# EAGLE schematic radiva5 (EAGLE 7.7.0)

## Sheet 1 of 2
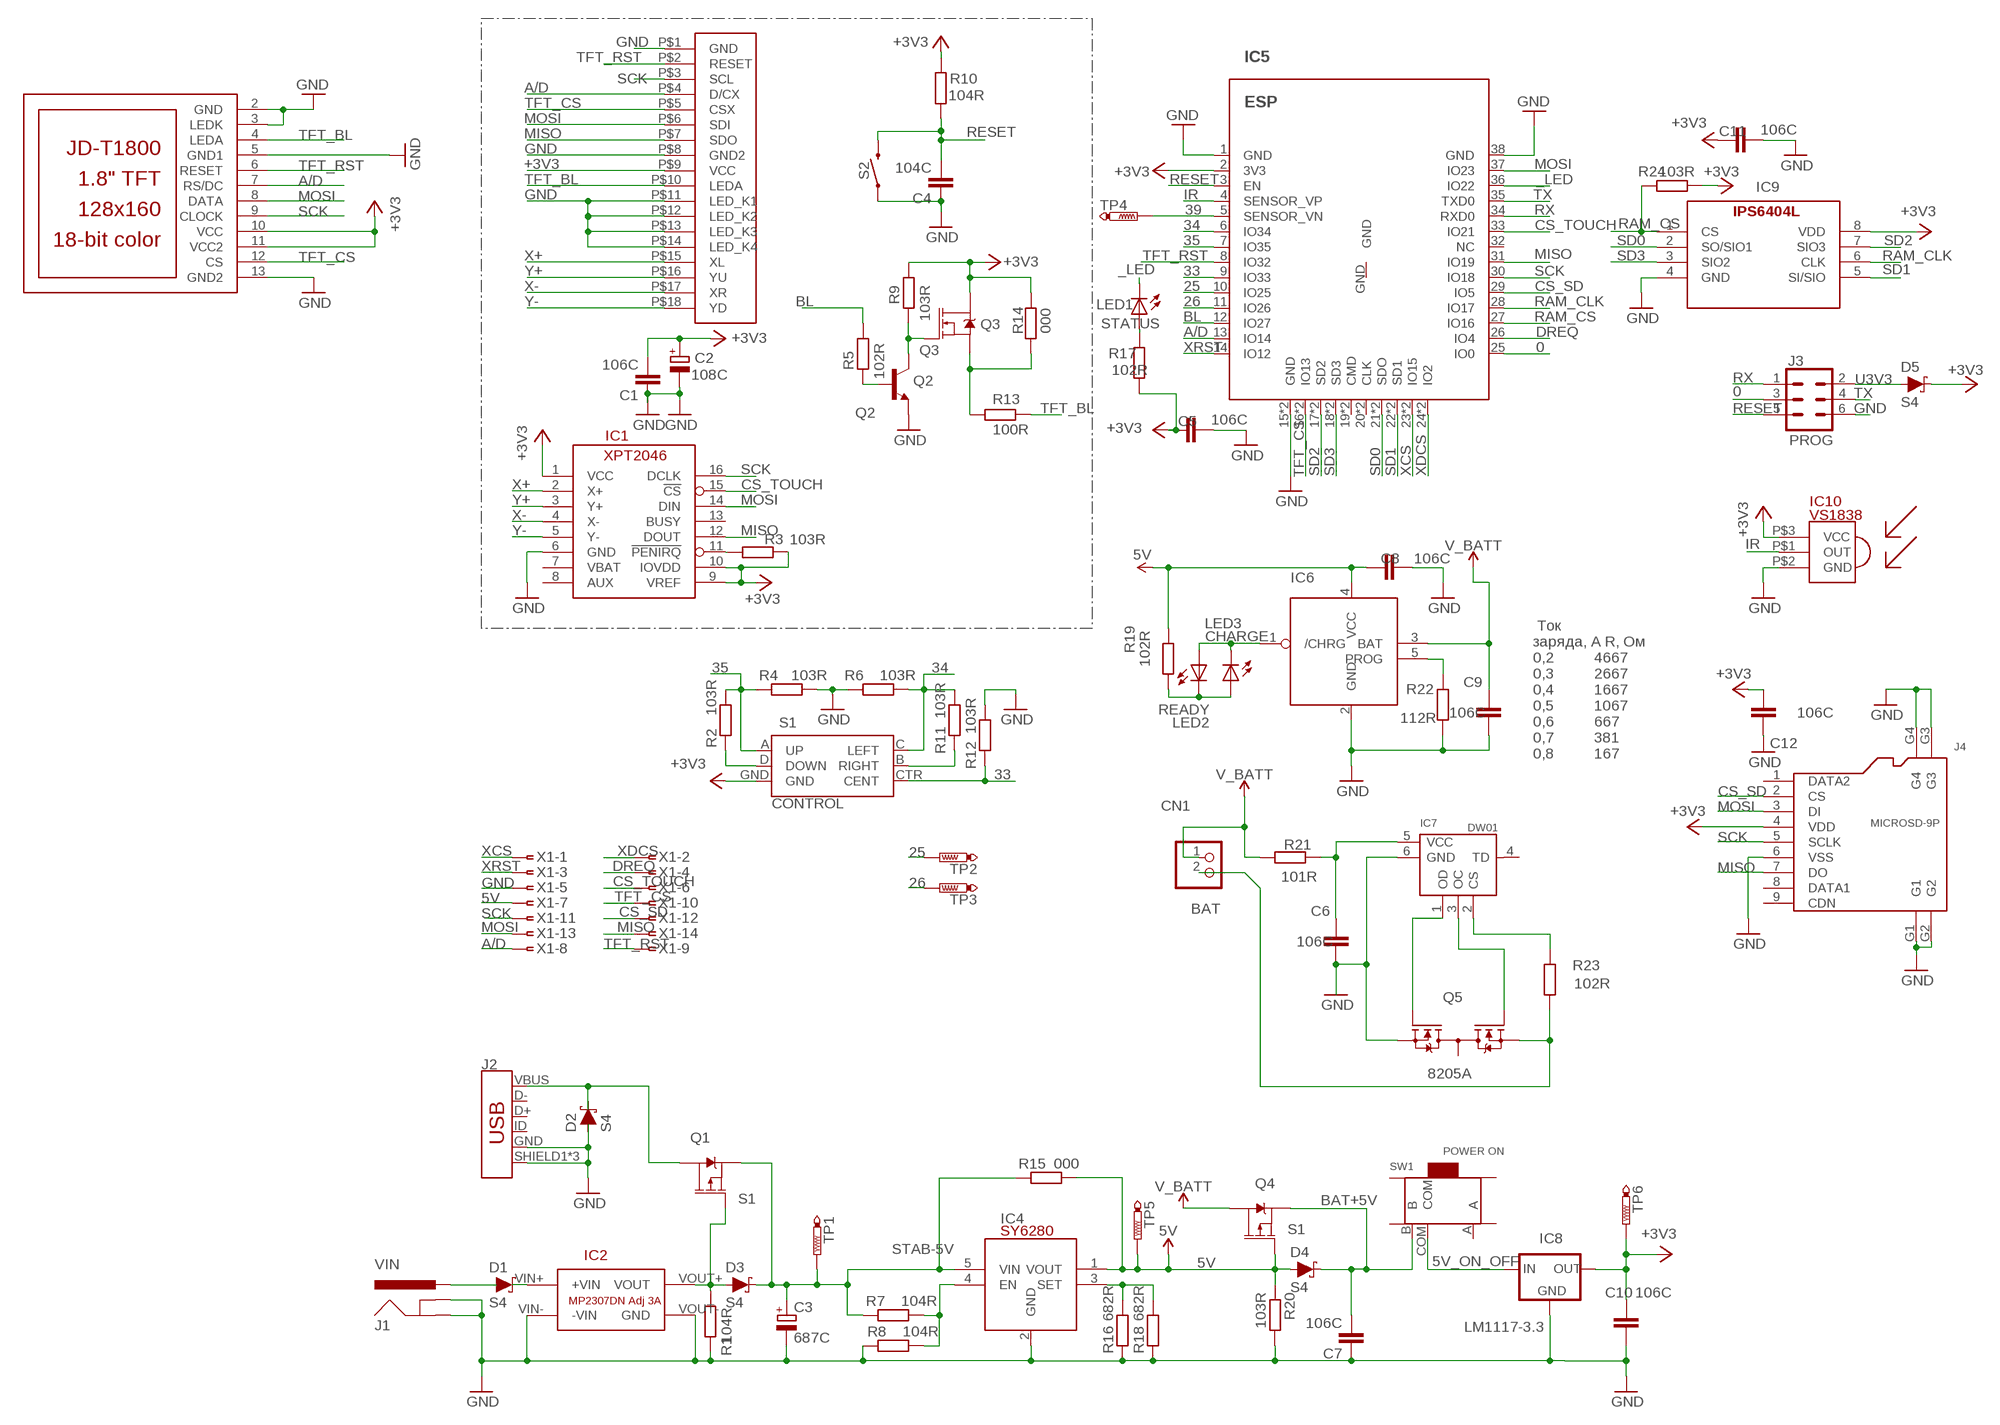
[diagram p0: schematic, sheet 1]

### Parts
C1  106C  CAP0603-CAP  [0603-CAP]
C2  108C  CPOL-EUE5-8.5  [E5-8,5]
C3  687C  CPOL-EUE5-8.5  [E5-8,5]
C4  104C  CAP0603-CAP  [0603-CAP]
C5  106C  CAP0603-CAP  [0603-CAP]
C6  106C  CAP0603-CAP  [0603-CAP]
C7  106C  CAP0603-CAP  [0603-CAP]
C8  106C  CAP0603-CAP  [0603-CAP]
C9  106C  CAP0603-CAP  [0603-CAP]
C10  106C  CAP0603-CAP  [0603-CAP]
C11  106C  CAP0603-CAP  [0603-CAP]
C12  106C  CAP0603-CAP  [0603-CAP]
CN1  BAT  JST_2PIN-SMT  [JST-PH-2-SMT]
D1  S4  DIODE-SCHOTTKY-BAT60A  [SOD-323]
D2  S4  DIODE-SCHOTTKY-BAT60A  [SOD-323]
D3  S4  DIODE-SCHOTTKY-BAT60A  [SOD-323]
D4  S4  DIODE-SCHOTTKY-BAT60A  [SOD-323]
D5  S4  DIODE-SCHOTTKY-BAT60A  [SOD-323]
IC1  TOUCH  XPT2046  [TSSOP16-0.65-5X4.4MM]
IC2  DC-DC 5V  DC-DC_MP2307DN  [DC-DC_MP2307DN]
IC3  TFT-DISPLAY-2.8  [TFT-DISPLAY-2.8]
IC4  SY6280  [SOT23-5]
IC5  ESP  ESP-WROOM-WROOVER-32  [ESP-WROOM-WROOVER-32]
IC6  LT4  TP4054  [SOT23-5]
IC7  DW01  [SOT-23-6]
IC8  LM1117-3.3  V_REG_LD1117VXXSMD  [SOT223]
IC9  SRAM  IPS6404L-SQ-SPN  [SO-08]
IC10  VS1838  [IR]
J1  VIN  POWER_JACKPTH_LOCK  [POWER_JACK_PTH_LOCK]
J2  USB_MICRO-B_FEMALE-SMT  [USB-B-MICRO-SMD]
J3  PROG  CONN_03X22X3_SILK_MALE_PTH  [2X3]
J4  MICROSD-9P  MICRO-SD-CARD-HOLDER-9P  [MICRO-SD9+4P-SMD-16.1X14.5X1.85MM]
LCD1  TFT-DISPLAY-1.8  JD-T1800  [JD-T1800]
LED1  STATUS  LED0603  [LED-0603]
LED2  READY  LED0603  [LED-0603]
LED3  CHARGE  LED0603  [LED-0603]
Q1  S1  CJ2301  [SOT23-3]
Q2  Q2  2N3904-SOT23  [SOT23-3]
Q3  Q3  MOSFET-NCH-2N7002  [SOT23-3]
Q4  S1  CJ2301  [SOT23-3]
Q5  8205A  [TSSOP-8]
R1  104R  R-EU_R0603  [R0603]
R2  103R  R-EU_R0603  [R0603]
R3  103R  R-EU_R0603  [R0603]
R4  103R  R-EU_R0603  [R0603]
R5  102R  R-EU_R0603  [R0603]
R6  103R  R-EU_R0603  [R0603]
R7  104R  R-EU_R0603  [R0603]
R8  104R  R-EU_R0603  [R0603]
R9  103R  R-EU_R0603  [R0603]
R10  104R  R-EU_R0603  [R0603]
R11  103R  R-EU_R0603  [R0603]
R12  103R  R-EU_R0603  [R0603]
R13  100R  R-EU_R0603  [R0603]
R14  000  R-EU_R0603  [R0603]
R15  000  R-EU_R0603  [R0603]
R16  682R  R-EU_R0603  [R0603]
R17  102R  R-EU_R0603  [R0603]
R18  682R  R-EU_R0603  [R0603]
R19  102R  R-EU_R0603  [R0603]
R20  103R  R-EU_R0603  [R0603]
R21  101R  R-EU_R0603  [R0603]
R22  112R  R-EU_R0603  [R0603]
R23  102R  R-EU_R0603  [R0603]
R24  103R  R-EU_R0603  [R0603]
S1  CONTROL  JOYSTICK_MINI  [JOYSTICK_MINI]
S2  RESET  MOMENTARY-SWITCH-SPST-PTH-8.0MM  [TACTILE_SWITCH_PTH_8.0MM]
SW1  POWER ON  SMD-TOGGLE-SWITCH-ON-ON(3+4P-6.7X2.7MM)  [SW7-SMD-L6.7X2.7X3.2MM]
TP1  STAB 5V  PTR1PAD1-13  [P1-13]
TP2  25  PTR1B1,27  [B1,27]
TP3  26  PTR1B1,27  [B1,27]
TP4  39  PTR1B1,27  [B1,27]
TP5  5V  PTR1PAD1-13  [P1-13]
TP6  3.3V  PTR1PAD1-13  [P1-13]
X1  FSIDE-14  [FSIDE-14]

### Nets
0: IC5.25(IO0) J3.3
5V: C8.1 D4.+(A) IC4.1(VOUT) IC6.4(VCC) Q4.1(G) R15.2 R19.2 R20.1 TP5.TP X1.7
5V_ON_OFF: IC8.3(IN) SW1.COM
25: IC5.10(IO25) TP2.TP
26: IC5.11(IO26) TP3.TP
33: IC5.9(IO33) R12.1 S1.CTR(CENT)
34: IC5.6(IO34) R6.2 R11.2 S1.C(LEFT)
35: IC5.7(IO35) R2.2 R4.1 S1.A(UP)
39: IC5.5(SENSOR_VN) TP4.TP
+3V3: C1.2 C2.+ C5.1 C10.2 C11.1 C12.1 D5.-(C) IC1.1(VCC) IC1.9(VREF) IC1.10(IOVDD) IC3.P$9(VCC) IC5.2(3V3) IC8.2(OUT) IC8.4(OUT) IC9.8(VDD) IC10.P$3(VCC) J4.4(VDD) LCD1.10(VCC) LCD1.11(VCC2) Q3.3(D) R3.1 R9.1 R10.1 R14.1 R17.1 R24.1 S1.GND TP6.TP ; also sheet 2
_LED: IC5.36(IO22) LED1.C
_VIN+: D1.-(C) IC2.VIN+(+VIN)
A/D: IC3.P$4(D/CX) IC5.13(IO14) LCD1.7(RS/DC) X1.8
BAT+5V: C7.2 D4.-(C) Q4.2(S) SW1.B
BL: IC5.12(IO27) R5.1
CHARGE: IC6.1(/CHRG) LED2.A LED3.C
CS_SD: IC5.29(IO5) J4.2(CS) X1.12
CS_TOUCH: IC1.15(!CS) IC5.33(IO21) X1.6
DREQ: IC5.26(IO4) X1.4 ; also sheet 2
FUSE_EN: IC4.4(EN) R7.2 R8.1
FUSE_SET: IC4.3(SET) R16.2 R18.2
GND: C1.1 C2.- C3.- C4.1 C5.2 C6.1 C7.1 C8.2 C9.1 C10.1 C11.2 C12.2 D2.+(A) IC1.6(GND) IC2.VIN-(-VIN) IC2.VOUT-(GND) IC3.P$1(GND) IC3.P$8(GND2) IC3.P$11(LED_K1) IC3.P$12(LED_K2) IC3.P$13(LED_K3) IC3.P$14(LED_K4) IC4.2(GND) IC5.1(GND) IC5.15(GND) IC5.38(GND) IC5.39(GND) IC6.2(GND) IC7.6(GND) IC8.1(GND) IC9.4(GND) IC10.P$2(GND) J1.GND J1.GNDBREAK J2.GND J2.SHIELD1(SHIELD) J2.SHIELD2(SHIELD) J2.SHIELD3(SHIELD) J3.6 J4.6(VSS) J4.G1 J4.G2 J4.G3 J4.G4 LCD1.2(GND) LCD1.3(LEDK) LCD1.5(GND1) LCD1.13(GND2) Q2.2(E) Q5.6(S2) Q5.7(S2) R1.2 R4.2 R6.1 R8.2 R12.2 R16.1 R18.1 R20.2 R22.1 S2.1 X1.5 ; also sheet 2
ICHRG: IC6.5(PROG) R22.2
IR: IC5.4(SENSOR_VP) IC10.P$1(OUT)
MISO: IC1.12(DOUT) IC3.P$7(SDO) IC5.31(IO19) J4.7(DO) X1.14 ; also sheet 2
MOSI: IC1.14(DIN) IC3.P$6(SDI) IC5.37(IO23) J4.3(DI) LCD1.8(DATA) X1.13 ; also sheet 2
N$1: Q2.3(C) Q3.1(G) R9.2
N$2: Q3.2(S) R13.1 R14.2
N$4: Q2.1(B) R5.2
N$5: LED1.A R17.2
N$6: LED2.C LED3.A R19.1
N$9: IC7.3(OC) Q5.4(G1)
N$10: IC7.1(OD) Q5.5(G2)
N$12: C6.2 IC7.5(VCC) R21.2
N$13: IC7.2(CS) R23.2
N$15: CN1.2 Q5.2(S1) Q5.3(S1) R23.1
N$35: IC1.11(!PENIRQ) R3.2
N$47: R11.1 S1.B(RIGHT)
N$50: R2.1 S1.D(DOWN)
RAM_CLK: IC5.28(IO17) IC9.6(CLK)
RAM_CS: IC5.27(IO16) IC9.1(CS) R24.2
RESET: C4.2 IC5.3(EN) J3.5 R10.2 S2.2
RX: IC5.34(RXD0) J3.1
SCK: IC1.16(DCLK) IC3.P$3(SCL) IC5.30(IO18) J4.5(SCLK) LCD1.9(CLOCK) X1.11 ; also sheet 2
SD0: IC5.21(SDO) IC5.45(SDO) IC9.2(SO/SIO1)
SD1: IC5.22(SD1) IC5.46(SD1) IC9.5(SI/SIO)
SD2: IC5.17(SD2) IC5.41(SD2) IC9.7(SIO3)
SD3: IC5.18(SD3) IC5.42(SD3) IC9.3(SIO2)
STAB-5V: C3.+ D3.-(C) IC4.5(VIN) Q1.2(S) R7.1 R15.1 TP1.TP
STAB_5V_OUT: D3.+(A) IC2.VOUT+(VOUT) Q1.1(G) R1.1
TFT_BL: IC3.P$10(LEDA) LCD1.4(LEDA) R13.2
TFT_CS: IC3.P$5(CSX) IC5.16(IO13) IC5.40(IO13) LCD1.12(CS) X1.10
TFT_RST: IC3.P$2(RESET) IC5.8(IO32) LCD1.6(RESET) X1.9
TX: IC5.35(TXD0) J3.4
U3V3: D5.+(A) J3.2
V_BATT: C9.2 CN1.1 IC6.3(BAT) Q4.3(D) R21.1
VBUS: D2.-(C) J2.VBUS Q1.3(D)
VIN+: D1.+(A) J1.PWR
X+: IC1.2(X+) IC3.P$15(XL)
X-: IC1.4(X-) IC3.P$17(XR)
XCS: IC5.23(IO15) IC5.47(IO15) X1.1 ; also sheet 2
XDCS: IC5.24(IO2) IC5.48(IO2) X1.2 ; also sheet 2
XRST: IC5.14(IO12) X1.3 ; also sheet 2
Y+: IC1.3(Y+) IC3.P$16(YU)
Y-: IC1.5(Y-) IC3.P$18(YD)
Unconnected: IC1.7(VBAT) IC1.8(AUX) IC1.13(BUSY) IC5.19(CMD) IC5.20(CLK) IC5.32(NC) IC5.43(CMD) IC5.44(CLK) IC5.GND IC7.4(TD) J2.D+ J2.D- J2.ID J4.1(DATA2) J4.8(DATA1) J4.9(CDN) Q5.1(D) Q5.8(D) SW1.A SW1.SS1 SW1.SS2 SW1.SS3 SW1.SS4

### Notes on the sheet
- Ток
  заряда, А R, Oм
  0,2          4667
  0,3          2667
  0,4          1667
  0,5          1067
  0,6          667
  0,7          381
  0,8          167

## Sheet 2 of 2: vs1053
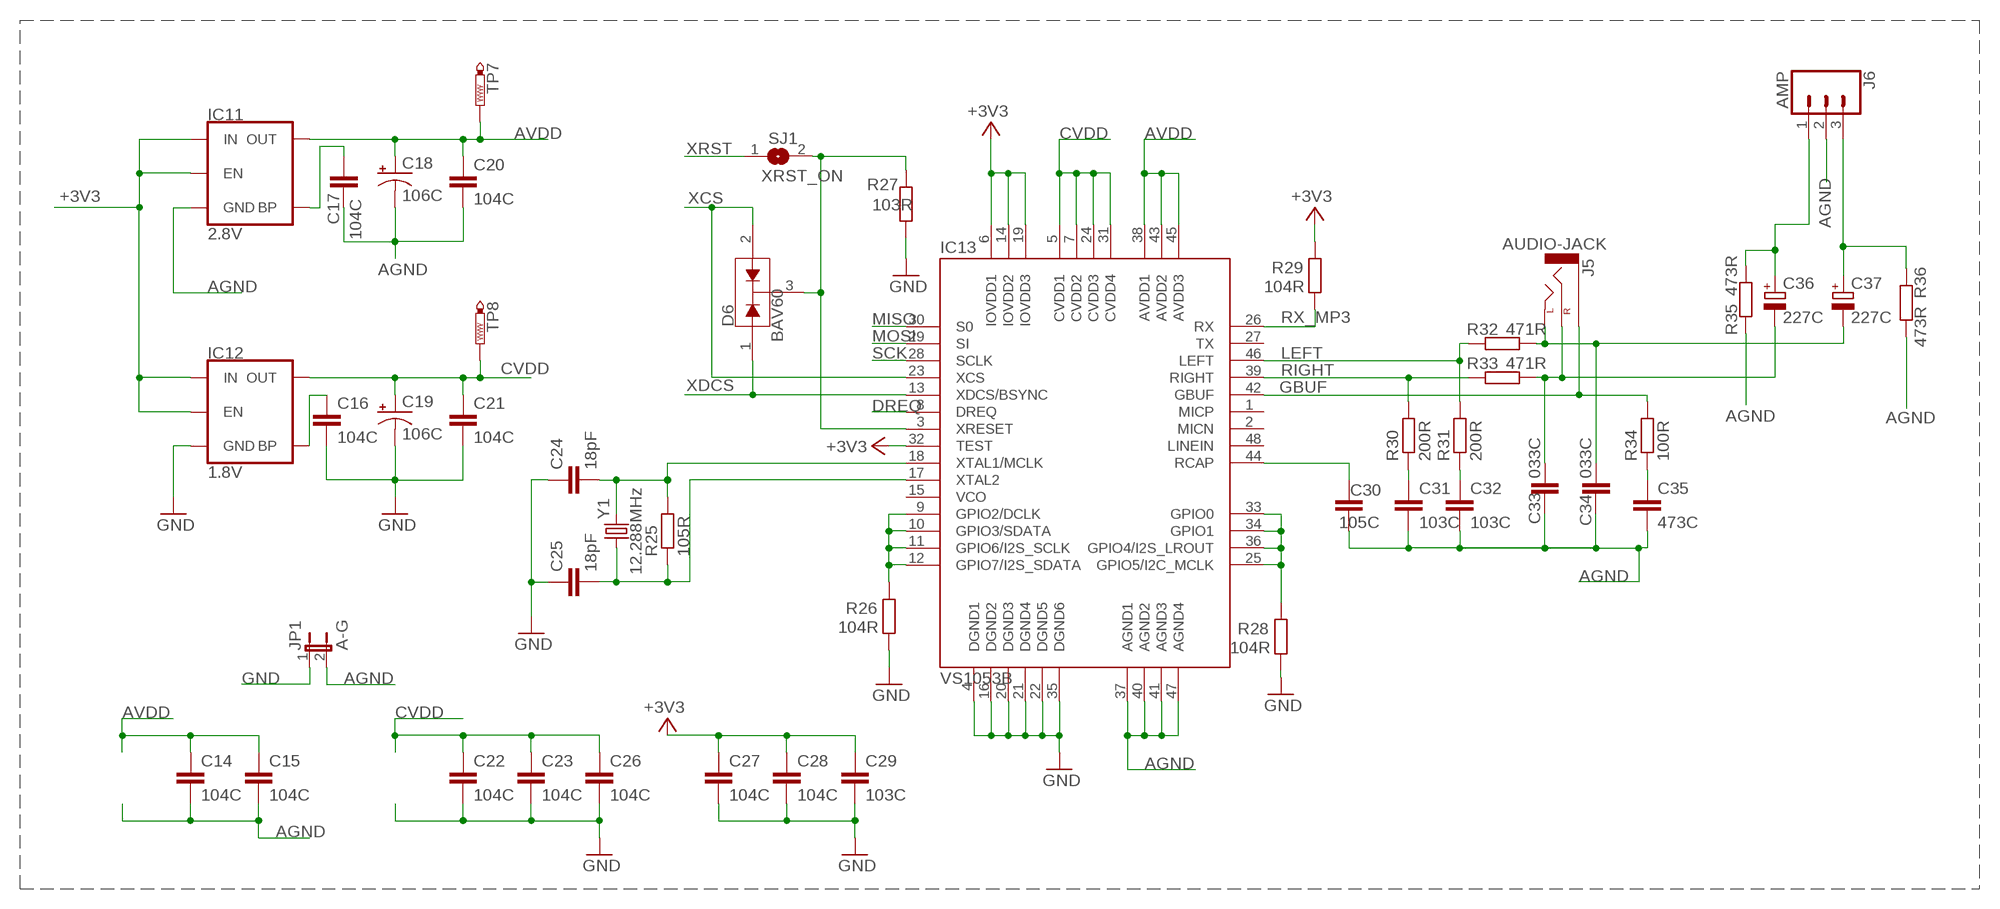
[diagram p1: schematic, sheet 2]

### Parts
C14  104C  CAP0603-CAP  [0603-CAP]
C15  104C  CAP0603-CAP  [0603-CAP]
C16  104C  CAP0603-CAP  [0603-CAP]
C17  104C  CAP0603-CAP  [0603-CAP]
C18  106C  CAP_POL1206  [EIA3216]
C19  106C  CAP_POL1206  [EIA3216]
C20  104C  CAP0603-CAP  [0603-CAP]
C21  104C  CAP0603-CAP  [0603-CAP]
C22  104C  CAP0603-CAP  [0603-CAP]
C23  104C  CAP0603-CAP  [0603-CAP]
C24  18pF  CAP0603-CAP  [0603-CAP]
C25  18pF  CAP0603-CAP  [0603-CAP]
C26  104C  CAP0603-CAP  [0603-CAP]
C27  104C  CAP0603-CAP  [0603-CAP]
C28  104C  CAP0603-CAP  [0603-CAP]
C29  103C  CAP0603-CAP  [0603-CAP]
C30  105C  CAP0603-CAP  [0603-CAP]
C31  103C  CAP0603-CAP  [0603-CAP]
C32  103C  CAP0603-CAP  [0603-CAP]
C33  033C  CAP0603-CAP  [0603-CAP]
C34  033C  CAP0603-CAP  [0603-CAP]
C35  473C  CAP0603-CAP  [0603-CAP]
C36  227C  CPOL-EUE2.5-6  [E2,5-6]
C37  227C  CPOL-EUE2.5-6  [E2,5-6]
D6  BAV60  BAV70  [SOT23-3]
IC11  2.8V  TPS79318  [SOT23-5]
IC12  1.8V  TPS79318  [SOT23-5]
IC13  VS1053B  VS1053SMD  [LQFP-48]
J5  AUDIO-JACK  [AUDIO-JACK]
J6  AMP  CONN_03  [1X03]
JP1  A-G  JUMPER-2SMD-NC  [SJ_2S]
R25  105R  R-EU_R0603  [R0603]
R26  104R  R-EU_R0603  [R0603]
R27  103R  R-EU_R0603  [R0603]
R28  104R  R-EU_R0603  [R0603]
R29  104R  R-EU_R0603  [R0603]
R30  200R  R-EU_R0603  [R0603]
R31  200R  R-EU_R0603  [R0603]
R32  471R  R-EU_R0603  [R0603]
R33  471R  R-EU_R0603  [R0603]
R34  100R  R-EU_R0603  [R0603]
R35  473R  R-EU_R0603  [R0603]
R36  473R  R-EU_R0603  [R0603]
SJ1  XRST_ON  SJ  [SJ]
TP7  2.8V  PTR1B1,27  [B1,27]
TP8  1.8V  PTR1B1,27  [B1,27]
Y1  12.288MHz  CRYSTALPTH-HC49UV  [HC49U]

### Nets
+3V3: C27.1 C28.1 C29.1 IC11.1(IN) IC11.3(EN) IC12.1(IN) IC12.3(EN) IC13.6(IOVDD1) IC13.14(IOVDD2) IC13.19(IOVDD3) IC13.32(TEST) R29.2 ; also sheet 1
AGND: C14.2 C15.2 C17.2 C18.C(-) C20.2 C30.1 C31.2 C32.2 C33.2 C34.2 C35.2 IC11.2(GND) IC13.37(AGND1) IC13.40(AGND2) IC13.41(AGND3) IC13.47(AGND4) J6.2 JP1.2 R35.2 R36.1
AMP_L: C36.+ J6.1 R35.1
AMP_R: C37.+ J6.3 R36.2
AVDD: C14.1 C15.1 C18.A(+) C20.1 IC11.5(OUT) IC13.38(AVDD1) IC13.43(AVDD2) IC13.45(AVDD3) TP7.TP
CVDD: C19.A(+) C21.1 C22.1 C23.1 C26.1 IC12.5(OUT) IC13.5(CVDD1) IC13.7(CVDD2) IC13.24(CVDD3) IC13.31(CVDD4) TP8.TP
DREQ: IC13.8(DREQ) ; also sheet 1
GBUF: IC13.42(GBUF) J5.P$3(SLEEVE) J5.P$4(SLEEVE) R34.2
GND: C16.2 C19.C(-) C21.2 C22.2 C23.2 C24.1 C25.1 C26.2 C27.2 C28.2 C29.2 IC12.2(GND) IC13.4(DGND1) IC13.16(DGND2) IC13.20(DGND3) IC13.21(DGND4) IC13.22(DGND5) IC13.35(DGND6) JP1.1 R26.1 R27.1 R28.1 ; also sheet 1
GPIO_0: IC13.25(GPIO5/I2C_MCLK) IC13.33(GPIO0) IC13.34(GPIO1) IC13.36(GPIO4/I2S_LROUT) R28.2
GPIO_2: IC13.9(GPIO2/DCLK) IC13.10(GPIO3/SDATA) IC13.11(GPIO6/I2S_SCLK) IC13.12(GPIO7/I2S_SDATA) R26.2
HP_L: C33.1 C36.- J5.P$2(RIGHT) R33.1
HP_R: C34.1 C37.- J5.P$1(LEFT) J5.P$5(LEFT) R32.1
LEFT: IC13.46(LEFT) R31.2 R32.2
MISO: IC13.30(S0) ; also sheet 1
MOSI: IC13.29(SI) ; also sheet 1
N$11: C17.1 IC11.4(BP)
N$14: C16.1 IC12.4(BP)
N$26: C32.1 R31.1
N$28: C31.1 R30.1
N$29: C35.1 R34.1
RCAP: C30.2 IC13.44(RCAP)
RIGHT: IC13.39(RIGHT) R30.2 R33.2
RX_MP3: IC13.26(RX) R29.1
SCK: IC13.28(SCLK) ; also sheet 1
XCS: D6.2(A2) IC13.23(XCS) ; also sheet 1
XDCS: D6.1(A1) IC13.13(XDCS/BSYNC) ; also sheet 1
XRESET: D6.3(COM) IC13.3(XRESET) R27.2 SJ1.2
XRST: SJ1.1 ; also sheet 1
XTAL+: C25.2 IC13.17(XTAL2) R25.1 Y1.1
XTAL-: C24.2 IC13.18(XTAL1/MCLK) R25.2 Y1.2
Unconnected: IC13.1(MICP) IC13.2(MICN) IC13.15(VCO) IC13.27(TX) IC13.48(LINEIN)

## Library data of the parts
C1 C4-C12 C14-C17 C20-C30 C32-C35 = radiva:CAP: Capacitor Standard 0603 ceramic capacitor, and 0.1" leaded capacitor.
C2 C3 = rcl:CPOL-EU: POLARIZED CAPACITOR, European symbol
C18 C19 = radiva:CAP_POL: Capacitor Polarized These are standard SMD and PTH capacitors. Normally 10uF, 47uF, and 100uF in electrolytic and tantalum varieties. Always verify the external diameter of the through hole cap, it varies with capacity, voltage, and manufacturer. The EIA devices should be standard.
C31 = SparkFun:CAP: Capacitor Standard 0603 ceramic capacitor, and 0.1" leaded capacitor.
C36 C37 = resistor:CPOL-EU: POLARIZED CAPACITOR, European symbol
CN1 = radiva:JST_2PIN: JST 2-Pin Connectors of various flavors SMT-RA (S2B-PH-SM4) 4UConnector #17311 SMT (B2B-PH-SM4) THM-RA (S2B-PH) THM (B2B-PH)
D1-D5 = radiva:DIODE-SCHOTTKY: Schottky diode A Schottky diode is a semiconductor diode which has a low forward voltage drop and a very fast switching action.; PROD_ID: DIO-14072; VALUE: 3A/10V/280mV
D6 = radiva:BAV70: Series-pair diode array Two small signal silicon diodes connected anode to cathode. Connections to all three nodes available. Link to datasheet <https://www.fairchildsemi.com/datasheets/BA/BAV99.pdf> SparkFun Products: SparkFun AutoDriver <?https://www.sparkfun.com/products/13752?>; PROD_ID: DIO-10647; VALUE: 200mA/70V
IC1 = radiva:XPT2046
IC2 = radiva:DC-DC_MP2307DN
IC3 = 32teeth - TFT Displays:TFT-DISPLAY-2.8
IC4 = radiva:SY6280
IC5 = radiva:ESP-WROOM-WROOVER-32
IC6 = radiva:TP4054
IC7 = li_fuse:DW01
IC8 = radiva:V_REG_LD1117VXX: LD1117VXX voltage regulator. We carry the 3.3V version (COM-00526) in TO-220 package.; PROD_ID: VREG-13917
IC9 = radiva:IPS6404L-SQ-SPN
IC10 = radiva:VS1838
IC11 IC12 = radiva:TPS79318: 200-mA Low-Dropout Regulator With EN Very Low Dropout Voltage (112 mV at Full Load, TPS79330)
IC13 = radiva:VS1053: VS1053B MP3 and MIDI Codec AAC/MP3/WMA/MIDI/Ogg Audio Player and Ogg Recording Device LQFP-48 7x7x1.4 mm Datasheet <http://www.sparkfun.com/datasheets/Components/SMD/vs1053.pdf> SparkFun Products Storefront component: MP3 and MIDI Codec - VS1053B <https://www.sparkfun.com/products/8892> (COM-08892) SparkFun MP3 Player Shield <https://www.sparkfun.com/products/12660> (DEV-12660) LilyPad MP3 <https://www.sparkfun.com/products/11013> (DEV-11013) SparkFun Music Instrument Shield <https://www.sparkfun.com/products/10587> (DEV-10587); PROD_ID: IC-12665
J1 = SparkFun-Connectors:POWER_JACK: Power Jack Connector This is the standard 5.5mm barrel jack for power. The PTH is the most common, proven, reliable, footprint. The Slot footprint only works if the mill layer is transmitted to the PCB fab house so be warned. Here are the connectors we sell at SparkFun: DC Barrel Power Jack/Connector <https://www.sparkfun.com/products/119> (PRT-00119) DC Barrel Power Jack/Connector (SMD) <https://www.sparkfun.com/products/12748> (PRT-12748) DC Barrel Jack Adapter - Breadboard Compatible <https://www.sparkfun.com/products/10811> (PRT-10811) It is used on this SparkFun product (and many, many others): SparkFun RedBoard - Programmed with Arduino <https://www.sparkfun.com/products/12757> (DEV-12757) Also, if you need a mating power supply or connector, please check these out: Wall Adapter Power Supply - 9VDC 650mA <https://www.sparkfun.com/products/298> (TOL-00298) DC Barrel Jack Adapter - Male <https://www.sparkfun.com/products/10287> (PRT-10287); PROD_ID: CONN-08197; SF_ID: PRT-00119
J2 = SparkFun-Connectors:USB_MICRO-B: USB Type Micro-B Connector Male/female and PTH/SMT variants SparkFun Products: SparkFun microB USB Breakout <https://www.sparkfun.com/products/12035> SparkFun USB microB Plug Breakout <https://www.sparkfun.com/products/10031> SparkFun ESP8266 Thing <https://www.sparkfun.com/products/13231>; PROD_ID: CONN-11752
J3 = SparkFun-Connectors:CONN_03X2: Multi connection point. Often used as Generic Header-pin footprint for 0.1 inch spaced/style header connections You can populate with any combo of single row headers, but if you'd like an exact match, check these: Header - 2x3 (Male, 0.1") <https://www.sparkfun.com/products/12807> (PRT-12807) Header - 2x3 (Female, 0.1") <https://www.sparkfun.com/products/13010> (PRT-13010) 2x3 Pin Shrouded Header <https://www.sparkfun.com/products/10877> (PRT-10877) On any of the 0.1 inch spaced packages, you can populate with these: Break Away Headers - Straight <https://www.sparkfun.com/products/116> (PRT-00116) Break Away Male Headers - Right Angle <https://www.sparkfun.com/products/553> (PRT-00553) Female Headers <https://www.sparkfun.com/products/115> (PRT-00115) Break Away Headers - Machine Pin <https://www.sparkfun.com/products/117> (PRT-00117) Break Away Female Headers - Swiss Machine Pin <https://www.sparkfun.com/products/743> (PRT-00743) Special note: the shrouded connector mates well with our 3x2 ribbon cables: Ribbon Crimp Connector - 6-pin (2x3, Female) <https://www.sparkfun.com/products/10651> (PRT-10651) Ribbon Cable - 6 wire (15ft) <https://www.sparkfun.com/products/10646> (PRT-10646); PROD_ID: CONN-09701
J4 = radiva:MICRO-SD-CARD-HOLDER-9P: 320090008
J5 = radiva:AUDIO-JACK
J6 = SparkFun-Connectors:CONN_03: Multi connection point. Often used as Generic Header-pin footprint for 0.1 inch spaced/style header connections On any of the 0.1 inch spaced packages, you can populate with these: Break Away Headers - Straight <https://www.sparkfun.com/products/116> (PRT-00116) Break Away Male Headers - Right Angle <https://www.sparkfun.com/products/553> (PRT-00553) Female Headers <https://www.sparkfun.com/products/115> (PRT-00115) Break Away Headers - Machine Pin <https://www.sparkfun.com/products/117> (PRT-00117) Break Away Female Headers - Swiss Machine Pin <https://www.sparkfun.com/products/743> (PRT-00743) Stackable Header - 3 Pin (Female, 0.1") <https://www.sparkfun.com/products/13875> (PRT-13875) For SCREWTERMINALS and SPRING TERMINALS visit here: Screw Terimnals on SparkFun.com <https://www.sparkfun.com/search/results?term=Screw+Terminals> (5mm/3.5mm/2.54mm spacing) This device is also useful as a general connection point to wire up your design to another part of your project. Our various solder wires solder well into these plated through hole pads. Hook-Up Wire - Assortment (Stranded, 22 AWG) <https://www.sparkfun.com/products/11375> (PRT-11375) Hook-Up Wire - Assortment (Solid Core, 22 AWG) <https://www.sparkfun.com/products/11367> (PRT-11367) View the entire wire category on our website here <https://www.sparkfun.com/categories/141> Special notes: Molex polarized connector foot print use with SKU : PRT-08232 with associated crimp pins and housings.; PROD_ID: XXX-00000; VALUE: 455-1750-1-ND
JP1 = SparkFun:JUMPER-2: Jumper Basic 0.1" spaced jumper. Use with breakaway headers.
LCD1 = radiva:JD-T1800
LED1-LED3 = SparkFun:LED: LEDs Standard schematic elements and footprints for 5mm, 3mm, 1206, and 0603 sized LEDs. 5mm - Spark Fun Electronics SKU : COM-00529 (and others)
Q1 Q4 = radiva:CJ2301
Q2 = radiva:2N3904: NPN Transistor
Q3 = radiva:MOSFET-NCH: N-channel MOSFETs Voltage controlled devices that allow control of high current outputs. SparkFun Products: SparkFun OpenScale <?https://www.sparkfun.com/products/13261?> SparkFun Digital Sandbox <?https://www.sparkfun.com/products/12651?> SparkFun Monster Moto Shield <?https://www.sparkfun.com/products/10182?> SparkFun MOSFET Power Controller <?https://www.sparkfun.com/products/11214?>
Q5 = li_fuse:8205A
R1-R36 = resistor:R-EU_: RESISTOR, European symbol
S1 = SparkFun-Switches:JOYSTICK_MINI: Small Tactile Joystick w/ Select Switch A 5-way tactile switch allows for a joystick-like interface in a very small package. Part #: 4UCON SF303GJ26 SparkFun Products 5-way Tactile Switch <https://www.sparkfun.com/products/10063> (COM-10063) Used on SparkFun Block for Intel® Edison - OLED <https://www.sparkfun.com/products/13035> (DEV-13035) Used on CAN-BUS Shield <https://www.sparkfun.com/products/13262> (DEV-13262); PROD_ID: SWCH-09905; SF_SKU: COM-10063
S2 = radiva:MOMENTARY-SWITCH-SPST: Momentary Switch (Pushbutton) - SPST Normally-open (NO) SPST momentary switches (buttons, pushbuttons). Variants PTH-12MM - 12mm square, through-hole Momentary Pushbutton Switch - 12mm Square <https://www.sparkfun.com/products/9190> (COM-09190) PTH-6.0MM, PTH-6.0MM-KIT - 6.0mm square, through-hole Mini Pushbutton Switch <https://www.sparkfun.com/products/97> (COM-00097) KIT package intended for soldering kit's - only one side of pads' copper is exposed. PTH-RIGHT-ANGLE-KIT - Right-angle, through-hole Right Angle Tactile Button <https://www.sparkfun.com/products/10791> - Used on SparkFun BigTime Watch Kit <https://www.sparkfun.com/products/11734> SMD-12MM - 12mm square, surface-mount Tactile Button - SMD (12mm) <https://www.sparkfun.com/products/12993> (COM-12993) Used on SparkFun PicoBoard <https://www.sparkfun.com/products/11888> SMD-4.5MM - 4.5mm Square Trackball Switch Used on SparkFun Blackberry Trackballer Breakout <https://www.sparkfun.com/products/13169> SMD-4.6MMX2.8MM - 4.60mm x 2.80mm, surface mount Used on SparkFun SAMD21 Mini Breakout <https://www.sparkfun.com/products/13664> SMD-5.2MM, SMD-5.2-REDUNDANT - 5.2mm square, surface-mount Mini Pushbutton Switch - SMD <https://www.sparkfun.com/products/8720> (COM-08720) Used on Arduino Pro Mini <https://www.sparkfun.com/products/11114> REDUNDANT package connects both switch circuits together SMD-6.0X3.5MM - 6.0 x 3.5mm, surface mount Momentary Reset Switch SMD <https://www.sparkfun.com/products/8229> (COM-08229) SMD-6.2MM-TALL - 6.2mm square, surface mount Tactile Button - SMD (6mm) <https://www.sparkfun.com/products/12992> Used on SparkFun Digital Sandbox <https://www.sparkfun.com/products/12651> SMD-RIGHT-ANGLE - Right-angle, surface mount Used on SparkFun Block for Intel® Edison - Arduino <https://www.sparkfun.com/products/13036>
SJ1 = jumper:SJ: SMD solder JUMPER
SW1 = Seeed-OPL-Switch:SMD-TOGGLE-SWITCH-ON-ON(3+4P-6.7X2.7MM): 311030001
TP1-TP8 = testpad:PTR1: TEST PIN
X1 = con-amp:FSIDE-14: AMP connector
Y1 = SparkFun-Clocks:CRYSTAL: Crystals (Generic) These are passive quartz crystals, which can be used as a clock source for a microcontroller. Crystal's are two-terminal devices. They require external "load" capacitors to generate an oscillating signal.

## Net classes
0 default: clearance 0.205 mm
1 power: width 0.406 mm